# Altium project ESP32-power-controller.PrjPcb (part 2 of 2)

## Sheet SMPS_3V3.SchDoc
size A4; DocumentNumber: 3; SheetNumber: 3; SheetTotal: 4
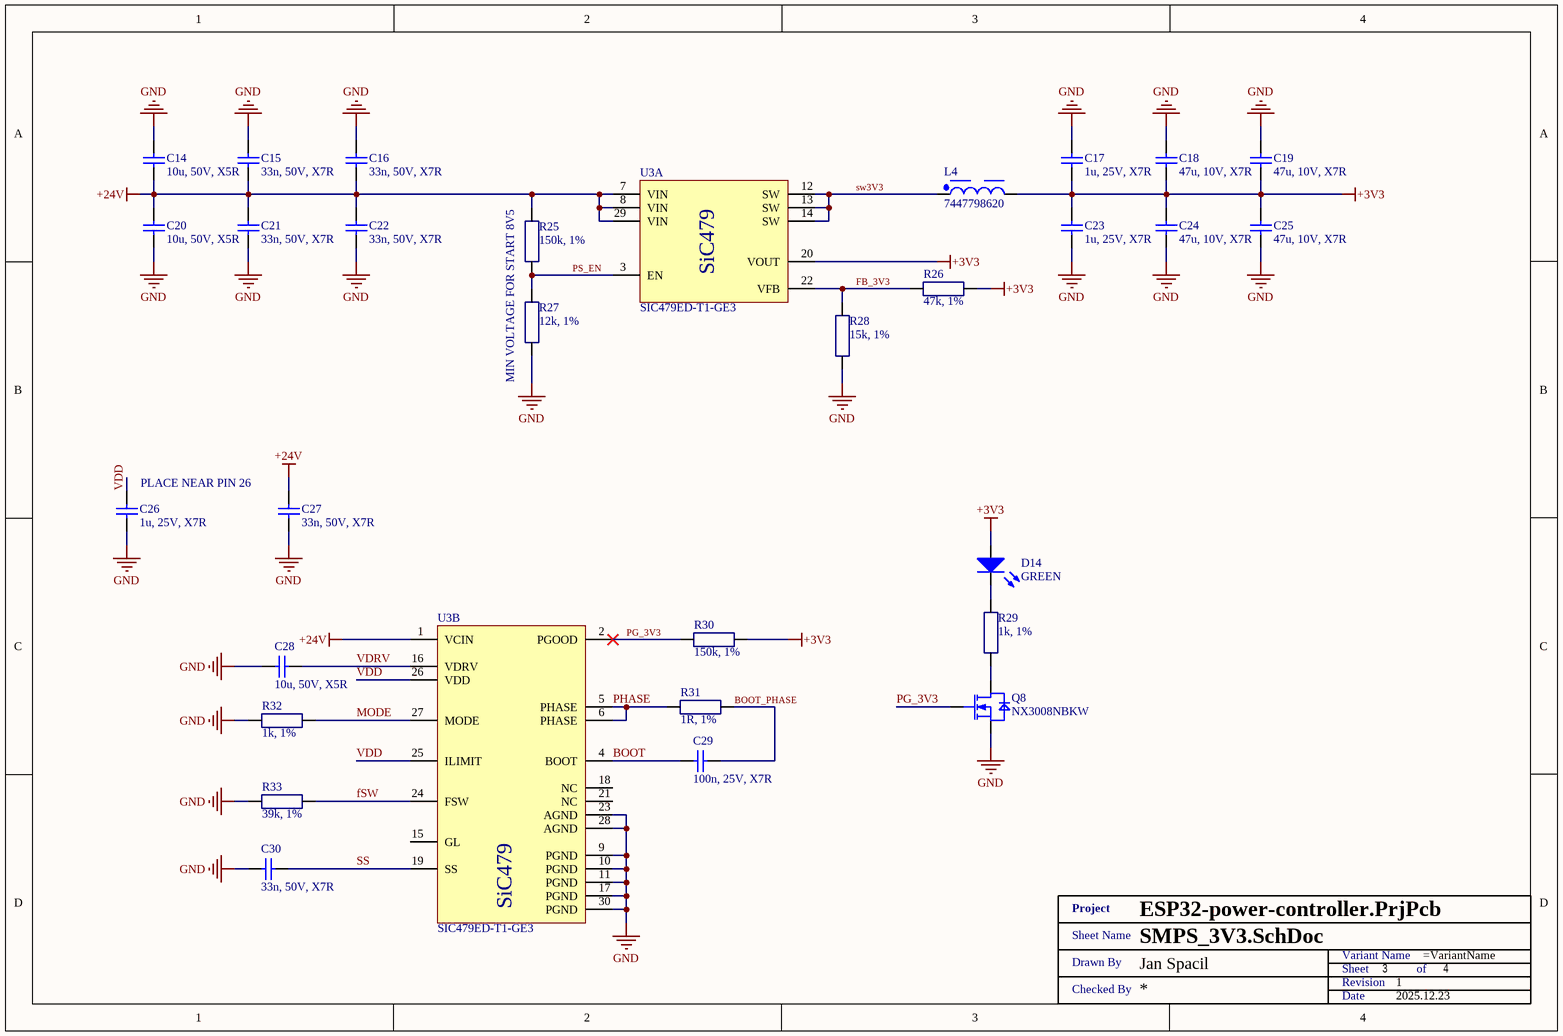
[diagram p2: SMPS_3V3.SchDoc]

### Parts
(Parts that share a designator on the sheet are numbered #1, #2 ... from top to bottom, then left to right.)
C14  10u, 50V, X5R  [SMD1206]
C15  33n, 50V, X7R  [SMD0603]
C16  33n, 50V, X7R  [SMD0603]
C17  1u, 25V, X7R  [SMD0603]
C18  47u, 10V, X7R  [SMD1210]
C19  47u, 10V, X7R  [SMD1210]
C20  10u, 50V, X5R  [SMD1206]
C21  33n, 50V, X7R  [SMD0603]
C22  33n, 50V, X7R  [SMD0603]
C23  1u, 25V, X7R  [SMD0603]
C24  47u, 10V, X7R  [SMD1210]
C25  47u, 10V, X7R  [SMD1210]
C26  1u, 25V, X7R  [SMD0603]
C27  33n, 50V, X7R  [SMD0603]
C28  10u, 50V, X5R  [SMD1206]
C29  100n, 25V, X7R  [SMD0603]
C30  33n, 50V, X7R  [SMD0603]
D14  GREEN  [MCL-S270]
L4  7447798620  [WE-PDF_1064]
Q8  NX3008NBKW  [SOT323]
R25  150k, 1%  [SMD0603 - R]
R26  47k, 1%  [SMD0603 - R]
R27  12k, 1%  [SMD0603 - R]
R28  15k, 1%  [SMD0603 - R]
R29  1k, 1%  [SMD0603 - R]
R30  150k, 1%  [SMD0603 - R]
R31  1R, 1%  [SMD0603 - R]
R32  1k, 1%  [SMD0603 - R]
R33  39k, 1%  [SMD0603 - R]
U3  SIC479ED-T1-GE3  [POWERPAK_MLP55-27L_VIS]  (parts A,B of 2)
XX?#3  Title 1  (value not drawn)  (graphical)

### Nets
+3V3: C17.1 C18.2 C19.2 C23.2 C24.2 C25.2 D14.1(A) L4.2 R26.2 R30.1 U3.20(VOUT)
+24V: C14.2 C15.1 C16.1 C20.2 C21.2 C22.2 C27.2 R25.2 U3.1(VCIN) U3.7(VIN) U3.8(VIN) U3.29(VIN)
GND: C14.1 C15.2 C16.2 C17.2 C18.1 C19.1 C20.1 C21.1 C22.1 C23.1 C24.1 C25.1 C26.1 C27.1 C28.2 C30.1 Q8.2(S) R27.1 R28.1 R32.1 R33.1 U3.9(PGND) U3.10(PGND) U3.11(PGND) U3.17(PGND) U3.23(AGND) U3.28(AGND) U3.30(PGND)
BOOT: C29.1 U3.4(BOOT)
BOOT_PHASE: C29.2 R31.2
FB_3V3: R26.1 R28.2 U3.22(VFB)
fSW: R33.2 U3.24(FSW)
MODE: R32.2 U3.27(MODE)
PG_3V3: Q8.1(G) R30.2 U3.2(PGOOD)
PHASE: R31.1 U3.5(PHASE) U3.6(PHASE)
PS_EN: R25.1 R27.2 U3.3(EN)
SS: C30.2 U3.19(SS)
sw3V3: L4.1 U3.12(SW) U3.13(SW) U3.14(SW)
VDD: C26.2 U3.25(ILIMIT) U3.26(VDD)
VDRV: C28.1 U3.16(VDRV)
NetD14_2: D14.2(K) R29.2
NetQ8_3: Q8.3(D) R29.1

Not connected (* = marked no-connect by the designer): U3 15(GL) 18(NC) 21(NC)

### Notes on the sheet
- MIN VOLTAGE FOR START 8V5
- (near C26) PLACE NEAR PIN 26
- (in symbol SIC479ED-T1-GE3, part A) SiC479
- (in symbol SIC479ED-T1-GE3, part B) SiC479
- (in symbol Title 1) Project; Sheet Name; Variant Name; Drawn By; Sheet; of; Revision; Checked By; Date

### Library data of the parts
C14 C20 C28 = UMK316BBJ106KL-T: CAP CER 10UF 50V X5R 1206; Manufacturer: Taiyo Yuden; Tolerance: 10%; Supplier 1: Mouser; Supplier Part Number 1: 963-UMK316BBJ106KL-T; Manufacturer Part Number: UMK316BBJ106KL-T; RoHS: Yes; Category: Ceramic Capacitors; Stock 1: 207945; Pricing 1: 1=0,42000, 10=0,18000, 100=0,12800, 500=0,11000, 1000=0,09700, 2000=0,08000 (USD); Mount: Surface Mount; Case/Package: 1206; Min Operating Temperature: -55°C; Max Operating Temperature: 85°C; Packaging: Tape and Reel; Capacitance: 10u; Voltage Rating: 50V; Length: 0.126inch; Width: 0.063inch; Thickness: 0.071inch; Lead Free: Lead Free; ComponentLink1URL: http://ds.yuden.co.jp/TYCOMPAS/ut/detail.do?productNo=UMK316BBJ106KL-T&fileName=UMK316BBJ106KL-T_SS&mode=specSheetDownload&src-supplier=Digi-Key; ComponentLink1Description: http://ds.yuden.co.jp/TYCOMPAS/ut/detail.do?productNo=UMK316BBJ106KL-T&fileName=UMK316BBJ106KL-T_SS&mode=specSheetDownload&src-supplier=Digi-Key; ComponentLink2URL: https://www.yuden.co.jp/productdata/catalog/mlcc01_e.pdf?src-supplier=Digi-Key; ComponentLink2Description: https://www.yuden.co.jp/productdata/catalog/mlcc01_e.pdf?src-supplier=Digi-Key; ComponentLink3URL: http://www.yuden.co.jp/productdata/catalog/en/mlcc_all_e.pdf?src-supplier=Digi-Key; ComponentLink3Description: http://www.yuden.co.jp/productdata/catalog/en/mlcc_all_e.pdf?src-supplier=Digi-Key; Supplier 2: Digi-Key; Supplier Part Number 2: 587-5960-1-ND; Supplier 3: Avnet; Supplier Part Number 3: UMK316BBJ106KL-T
C15 C16 C21 C22 C27 C30 = 06035C333JAT2A: 0603 33nF Ceramic Multilayer Capacitor; 50 V dc; +125degC; X7R Dielectric; +/-5%; Manufacturer: Kyocera AVX; Tolerance: 5%; Dissipation Factor: 2.5%; Supplier 1: Mouser; Supplier Part Number 1: 581-06035C333J; Manufacturer Part Number: 06035C333JAT2A; Stock 1: 266948; Pricing 1: 1 = 0.13000, 10 = 0.12100, 50 = 0.12100, 100 = 0.06000, 1000 = 0.03600, 10000 = 0.02400 (USD); RoHS: Yes; Mount: Surface Mount,PCB; Case/Package: 0603; Number of Pins: 2; Case Code (Metric): 1608; Case Code (Imperial): 0603; Contact Plating: Tin,Matte; Dielectric Material: Ceramic; Min Operating Temperature: -55°C; Max Operating Temperature: 125°C; Capacitance: 33n; Dielectric: X7R; Packaging: Tape and Reel; Voltage Rating (DC): 50V; Package Quantity: 1; Voltage Rating: 50V; Termination: SMD/SMT; Voltage: 50V; Length: 1.6mm; Height: 0.9mm; Width: 0.032inch; Depth: 0.81mm; Thickness: 0.035inch; Radiation Hardening: No; REACH SVHC: No SVHC; Lead Free: Lead Free; ComponentLink1URL: https://datasheet.ciiva.com/7855/1679506-7855093.pdf?src-supplier=Element14; ComponentLink1Description: https://datasheet.ciiva.com/7855/1679506-7855093.pdf?src-supplier=Element14; ComponentLink2URL: https://datasheet.ciiva.com/28694/cx7r-28694479.pdf?src-supplier=Element14; ComponentLink2Description: https://datasheet.ciiva.com/28694/cx7r-28694479.pdf?src-supplier=Element14; ComponentLink3URL: https://datasheet.ciiva.com/152/cx7r-152032.pdf?src-supplier=Digi-Key; ComponentLink3Description: https://datasheet.ciiva.com/152/cx7r-152032.pdf?src-supplier=Digi-Key; ComponentLink4URL: https://datasheet.ciiva.com/152/cx7r-152033.pdf?src-supplier=Digi-Key; ComponentLink4Description: https://datasheet.ciiva.com/152/cx7r-152033.pdf?src-supplier=Digi-Key; ComponentLink5URL: https://datasheet.ciiva.com/1457/84526-1457941.pdf?src-supplier=Element14; ComponentLink5Description: https://datasheet.ciiva.com/1457/84526-1457941.pdf?src-supplier=Element14; ComponentLink6URL: https://datasheet.ciiva.com/1457/84526-1457942.pdf?src-supplier=Element14; ComponentLink6Description: https://datasheet.ciiva.com/1457/84526-1457942.pdf?src-supplier=Element14; ComponentLink7URL: https://datasheet.ciiva.com/17084/cx7r-17084518.pdf?src-supplier=Future+Electronics; ComponentLink7Description: https://datasheet.ciiva.com/17084/cx7r-17084518.pdf?src-supplier=Future+Electronics; ComponentLink8URL: https://datasheet.ciiva.com/2987/cx7r-2987848.pdf?src-supplier=Avnet; ComponentLink8Description: https://datasheet.ciiva.com/2987/cx7r-2987848.pdf?src-supplier=Avnet; ComponentLink9URL: https://datasheet.ciiva.com/14605/70001075-14605242.pdf?src-supplier=Allied+Electronics; ComponentLink9Description: https://datasheet.ciiva.com/14605/70001075-14605242.pdf?src-supplier=Allied+Electronics; ComponentLink10URL: https://datasheet.ciiva.com/152/cx7r-152031.pdf?src-supplier=Digi-Key; ComponentLink10Description: https://datasheet.ciiva.com/152/cx7r-152031.pdf?src-supplier=Digi-Key; Supplier 2: Farnell; Supplier Part Number 2: 2280893; Supplier 3: Digi-Key; Supplier Part Number 3: 478-3723-1-ND; Supplier 4: Arrow; Supplier Part Number 4: 06035C333JAT2A
C17 C23 C26 = CGA3E1X7R1E105K080AC: CAP CER 1UF 25V X7R 0603; Manufacturer: TDK Corporation; Tolerance: ±10%; Manufacturer Part Number: CGA3E1X7R1E105K080AC; RoHS: RoHS Compliant; Category: Capacitors; Stock 1: 109509; Pricing 1: 1=0.2, 10=0.135, 100=0.0686, 500=0.04696, 1000=0.04154 (USD); Packaging: Cut Tape (CT); Part Status: Active; Voltage - Rated: 25V; Temperature Coefficient: X7R; Operating Temperature: -55°C ~ 125°C; Features: -; Ratings: AEC-Q200; Applications: Automotive; Failure Rate: -; Mounting Type: Surface Mount, MLCC; Package / Case: 0603 (1608 Metric); Size / Dimension: 0.063" L x 0.032" W (1.60mm x 0.80mm); Height - Seated (Max): -; Thickness (Max): 0.035" (0.90mm); Lead Spacing: -; Lead Style: -; ComponentLink1URL: https://product.tdk.com/info/en/catalog/datasheets/mlcc_automotive_general_en.pdf; ComponentLink1Description: https://product.tdk.com/info/en/catalog/datasheets/mlcc_automotive_general_en.pdf; Capacitance: 1u; Supplier 1: Mouser; Supplier Part Number 1: 810-CGA3E1X7R1E105K; Supplier 2: Farnell; Supplier Part Number 2: 2346962; Supplier 3: Digi-Key; Supplier Part Number 3: 445-6931-1-ND
C18 C19 C24 C25 = CL32B476MPJNNNE: Cap Ceramic 47uF 10V X7R 20% Pad SMD 1210 125C T/R; Manufacturer: Samsung; Supplier 1: Mouser; Supplier Part Number 1: 187-CL32B476MPJNNNE; Manufacturer Part Number: CL32B476MPJNNNE; RoHS: Yes; Category: Ceramic Capacitors; Stock 1: 61232; Pricing 1: 1=0.51, 10=0.377, 50=0.377, 100=0.263, 1000=0.198, 10000=0.163 (USD); Case/Package: 1210; Dielectric: X7R; Voltage Rating (DC): 10V; Tolerance: 20%; Value: 47uF; RoHS Compliant: Yes; ComponentLink1URL: http://www.samsungsem.com/kr/support/library/product-catalog/__icsFiles/afieldfile/2014/11/13/MLCC.pdf?src-supplier=Avnet; ComponentLink1Description: http://www.samsungsem.com/kr/support/library/product-catalog/__icsFiles/afieldfile/2014/11/13/MLCC.pdf?src-supplier=Avnet; Supplier 2: Arrow Electronics; Supplier Part Number 2: CL32B476MPJNNNE
C29 = 06033C104KAT2A: AVX - 06033C104KAT2A - CAP, MLCC, X7R, 0.1UF, 25V, 0603; Ceramic Capacitor Case: 0603 [1608 Metric]; Voltage Rating: 25; Capacitance Tolerance: ± 10%; Dielectric Characteristic: X7; Product Range: AVX 0603 MLCC; SVHC: No SVHC (17-Dec-2015)<!--FANDB--><div class="features-and-benefits-container"><div class="features-and-benefits-desc-container"><span class="features-and-benefits-container-desc">SMD Multilayer Ceramic Capacitor, 0603 [1608 Metric], 0.1 µF, 25 V, ± 10%, X7R, AVX 0603 MLCC</span></div><div class="features-and-benefits-description"><span class="features-benefits-value">The 06033C104KAT2A is a SMD Multilayer Ceramic Capacitor with Ni/Sn-plated termination, X7R dielectric and 0603 case. X7R formulations are called temperature stable ceramics and fall into EIA class II materials. X7R is the most popular of this intermediate dielectric constant material. This capacitance change is non-linear. Capacitance for X7R varies under the influence of electrical operating conditions such as voltage and frequency. X7; Supplier 1: Farnell; Supplier Part Number 1: 2530141; Manufacturer: AVX; Manufacturer Part Number: 06033C104KAT2A; RoHS: YES; Stock 1: 22809; Pricing 1: 10=0.012, 100=0.0096, 500=0.0069, 1000=0.006, 2000=0.0048, 4000=0.0038, 20000=0.0027, 40000=0.0026 (GBP); Capacitance: 100n; Packaging: Cut Tape; Operating Temperature Min: -55; Operating Temperature Max: 125; Automotive Qualification Standard: -; MSL: MSL 1 - Unlimited; ComponentLink1URL: http://www.farnell.com/datasheets/2237835.pdf; ComponentLink1Description: http://www.farnell.com/datasheets/2237835.pdf; Supplier 2: Digi-Key; Supplier Part Number 2: 478-3714-1-ND
D14 = MCL-S270GC: MULTICOMP - MCL-S270GC - LED, 0805, GREEN, 10MCD, 570NM; LED Mounting: SMD; Bulb Size: 1.25mm x 1.4; Forward Current If: 20; Forward Voltage: 2.1; Wavelength Typ: 570; Luminous Intensity: 10; Viewing Angle: 140°; Lens Shape: Rectangular; SVHC: No SVHC (17-Dec-2015); Forward Voltage VF Max: 2.6; LED / Lamp Size: 1.4mm x 1.25; LED Type: Standard; Luminous Intensity Max: 16; Luminous Intensity Min: 4.5; No. of Pins: 2; Peak Forward Current: 100; Peak Wavelength: 568; Reverse Protection Voltage: 5; Voltage Vf Min: 1.7; Voltage Vf Typ: 2.1V<!--FANDB--><div class="features-and-benefits-container"><div class="features-and-benefits-description"><span class="features-benefits-value">The MCL-S270GC is a green SMD LED made of GaP dice. This LED offers water clear rectangular lens and 260°C for 5 seconds lead soldering temperature range 1.6mm from body.</span></div><div class="features-and-benefits-list"><ul class="features-and-benefits-list-list"><li class="features-and-benefits-list-item">-40 to 85; Manufacturer: MULTICOMP; Manufacturer Part Number: MCL-S270GC; RoHS: YES; Stock 1: 80989; Pricing 1: 5=0,145, 25=0,136, 100=0,126, 250=0,0813, 500=0,0645, 2000=0,0559, 5000=0,0496, 20000=0,0434 (GBP); LED Colour: Green; Packaging: Cut Tape; Product Range: -; Automotive Qualification Standard: -; MSL: MSL 3 - 168 hours; Current Rating: 20; Dominant Wavelength: 570; Dominant Wavelength Typ: 570; Forward Current If Max: 20; Luminous Intensity Typ: 10; Operating Temperature Max: 85; Operating Temperature Min: -40; Operating Temperature Range: -40°C to +85; Storage Temperature Max: +100; Storage Temperature Min: -40; ComponentLink1URL: http://www.farnell.com/cad/53028.pdf; ComponentLink1Description: http://www.farnell.com/cad/53028.pdf; ComponentLink2URL: http://www.farnell.com/datasheets/1671537.pdf; ComponentLink2Description: http://www.farnell.com/datasheets/1671537.pdf; Supplier 1: Farnell; Supplier Part Number 1: 1581242; Supplier 2: Newark; Supplier Part Number 2: 14N9356
L4 = CMP-0227-00046-2: NexarPartId: 14415868; Tolerance: 30%; RMS Current (Irms): 9.4A; Shielding: Shielded; DC Resistance (DCR): 8.4mΩ; Self Resonant Frequency: 33MHz; Max DC Current: 7A; Test Frequency: 100kHz; Core Material: Composite, Ferrite, Metal; Inductance: 6.2µH; Saturation Current: 6.7A; Number of Pins: 2; Depth: 10.2mm; Length: 10.2mm; Termination: SMD/SMT; Ambient Temperature Range High: 110°C; Max Operating Temperature: 150°C; Mount: Surface Mount; Lead Pitch: 5.8mm; Inductance Tolerance: 30%; REACH SVHC: No SVHC; Width: 10.2mm; Min Operating Temperature: -40°C; Case/Package: 1064; Height - Seated (Max): 6.4008mm; RoHS: Compliant; Current Rating: 9.4A; Ambient Temperature Range Low: -40°C; Height: 6.1mm; Composition: Wirewound; Packaging: Tape & Reel (TR)
Q8 = NX3008NBKW: NXP - NX3008NBKW - MOSFET, N CH, 30V, 350MA, SOT323; Transistor Polarity: N Channel; Continuous Drain Current Id: 350; Drain Source Voltage Vds: 30; On Resistance Rds(on): 1; Rds(on) Test Voltage Vgs: 4.5; Threshold Voltage Vgs: 900; Power Dissipation Pd: 260; Transistor Case Style: SOT-323; No. of Pins: 3; SVHC: No SVHC (17-Dec-2015); Pulse Current Idm: -0.8; Voltage Vgs th Max: 8; Manufacturer: NXP; Manufacturer Part Number: NX3008NBKW; RoHS: YES; Stock 1: 4764; Pricing 1: 1=0.0425, 25=0.0385, 100=0.0347, 250=0.0334, 500=0.0312, 2000=0.0291, 4000=0.0282, 20000=0.0273 (GBP); Operating Temperature Max: 150; Product Range: -; Automotive Qualification Standard: -; MSL: MSL 1 - Unlimited; Operating Temperature Min: -55; Operating Temperature Range: -55°C to +150; ComponentLink1URL: http://www.farnell.com/datasheets/1508392.pdf; ComponentLink1Description: http://www.farnell.com/datasheets/1508392.pdf; Supplier 1: Mouser; Supplier Part Number 1: 771-NX3008NBKW,115; Supplier 2: Farnell; Supplier Part Number 2: 2069546; Supplier 3: Arrow; Supplier Part Number 3: NX3008NBKW,115
R25 R30 = RC0603FR-07150KL: YAGEO - RC0603FR-07150KL - RES, 150K, 1%, 0.1W, 0603, THICK FILM; Product Range: RC Series; Voltage Rating: 75; Resistor Case Style: 0603 [1608 Metric]; Power Rating: 100; Temperature Coefficient: ± 100; SVHC: No SVHC (27-Jun-2018); External Depth: 0.45; External Length / Height: 1.6; External Width: 0.8; Full Power Rating Temperature: 70; No. of Pins: 2; Reel Quantity: 5000; Resistor Mounting: Surface Mount Device; Voltage Rating V DC: 50V<!--FANDB--><div class="features-and-benefits-container"><div class="features-and-benefits-desc-container"><span class="features-and-benefits-container-desc">SMD Chip Resistor, 150 kohm, RC Series, 75 V, Thick Film, 0603 [1608 Metric], 100 mW</span></div><div class="features-and-benefits-description"><span class="features-benefits-value">The Yageo RC_L series resistors are general purpose thick film chip resistors with lead free terminations made by thick film process. The resistance range includes E24 and E96 decade values from 1ohm to 100Mohm. These resistors are constructed on top of a high grade ceramic body.</span></div><div class="features-and-benefits-list"><ul class="features-and-benefits-list-list"><li class="features-and-benefits-list-item">EIA 0075, 0100, 0201, 0402, 0603, 0805, 1206, 1210, 1218, 2010, 2512 case sizes available</li><li class="features-and-benefits-list-item">Small chip sizes save PCB space</li><li class="features-and-benefits-list-item">Rated voltage range of 10V to 200V</li><li class="features-and-benefits-list-item">Maximum power rating of 2W</li><li class="features-and-benefits-list-item">Available in ±0.1%, ±0.5%, ±1% and ±5% tolerance</li><li class="features-and-benefits-list-item">High component and equipment reliability</li><li class="features-and-benefits-list-item">Forbidden materials are not used in products/production</li><li class="features-and-benefits-list-item">-55°C to 155°C temperature range for RC0402 to RC2512 and -55°C to 125°C for RC0075 to RC0201; Manufacturer: YAGEO; Manufacturer Part Number: RC0603FR-07150KL; RoHS: YES; Pricing 1: 10=0.678, 100=0.557, 500=0.39, 1000=0.326, 2500=0.244 (EUR); Resistance: 150k; Resistor Element Material: Thick Film; Resistance Tolerance: ± 1%; Automotive Qualification Standard: -; MSL: MSL 1 - Unlimited; Operating Temperature Max: 155; Operating Temperature Min: -55; Operating Temperature Range: -55°C to +155; Temperature Coeff. +: 100; Temperature Coeff. -: 100; Tolerance +: 1%; Tolerance -: 1%; ComponentLink1URL: http://www.farnell.com/datasheets/2167052.pdf; ComponentLink1Description: http://www.farnell.com/datasheets/2167052.pdf; ComponentLink2URL: http://www.farnell.com/cad/1555201.zip; ComponentLink2Description: http://www.farnell.com/cad/1555201.zip; Supplier 1: Mouser; Supplier Part Number 1: 603-RC0603FR-07150KL; Supplier 2: Farnell; Supplier Part Number 2: 9238743; Supplier 3: Digi-Key; Supplier Part Number 3: 311-150KHRCT-ND
R26 = RC0603FR-0747KL: RES SMD 47K OHM 1% 1/10W 0603; Manufacturer: Yageo; Temperature Coefficient: 100ppm/°C; Voltage Rating (DC): 50V; Power Rating: 100mW; Supplier 1: Mouser; Supplier Part Number 1: 603-RC0603FR-0747KL; Manufacturer Part Number: RC0603FR-0747KL; Stock 1: 2684548; Pricing 1: 1 = 0.10000, 10 = 0.01800, 50 = 0.01800, 100 = 0.00600, 1000 = 0.00500, 5000 = 0.00300, 10000 = 0.00300, 50000 = 0.00200 (USD); RoHS: Yes; Case/Package: 0603; Number of Pins: 2; Case Code (Metric): 1608; Case Code (Imperial): 0603; Min Operating Temperature: -55°C; Max Operating Temperature: 155°C; Tolerance: 1%; Composition: Thick Film; Resistance: 47k; Packaging: Tape and Reel; Voltage Rating: 50V; Package Quantity: 1; Number of Terminations: 2; Termination: SMD/SMT; Military Standard: Not; Max Power Dissipation: 100mW; Features: Moisture Resistant; Length: 1.6mm; Height: 0.022inch; Width: 0.031inch; Depth: 0.8mm; REACH SVHC: Unknown; Lead Free: Lead Free; ComponentLink1URL: https://datasheet.ciiva.com/11808/0900766b80f96399-11808118.pdf?src-supplier=RSComponents; ComponentLink1Description: https://datasheet.ciiva.com/11808/0900766b80f96399-11808118.pdf?src-supplier=RSComponents; ComponentLink2URL: https://datasheet.ciiva.com/7746/443971-7746361.pdf?src-supplier=Element14; ComponentLink2Description: https://datasheet.ciiva.com/7746/443971-7746361.pdf?src-supplier=Element14; ComponentLink3URL: https://datasheet.ciiva.com/7746/443971-7746362.pdf?src-supplier=Element14; ComponentLink3Description: https://datasheet.ciiva.com/7746/443971-7746362.pdf?src-supplier=Element14; ComponentLink4URL: https://datasheet.ciiva.com/2453/pyu-r-int-thick-7-2453931.pdf?src-supplier=Digi-Key; ComponentLink4Description: https://datasheet.ciiva.com/2453/pyu-r-int-thick-7-2453931.pdf?src-supplier=Digi-Key; ComponentLink5URL: https://datasheet.ciiva.com/2453/pyu-r-int-thick-7-2453932.pdf?src-supplier=Digi-Key; ComponentLink5Description: https://datasheet.ciiva.com/2453/pyu-r-int-thick-7-2453932.pdf?src-supplier=Digi-Key; ComponentLink6URL: https://datasheet.ciiva.com/2453/pyu-r-int-thick-7-2453933.pdf?src-supplier=Digi-Key; ComponentLink6Description: https://datasheet.ciiva.com/2453/pyu-r-int-thick-7-2453933.pdf?src-supplier=Digi-Key; Supplier 2: Farnell; Supplier Part Number 2: 2421877; Supplier 3: Digi-Key; Supplier Part Number 3: 311-47.0KHRCT-ND
R27 = RCS060312K0FKEA: RES SMD 12K OHM 1% 1/4W 0603; Manufacturer: Vishay Dale; Power (Watts): 0.25W, 1/4W; Temperature Coefficient: ±100ppm/°C; Manufacturer Part Number: RCS060312K0FKEA; RoHS: RoHS Compliant; Category: Resistors; Stock 1: 0; Pricing 1: 5000=0.01664, 10000=0.01513 (USD); Packaging: Tape & Reel (TR); Part Status: Active; Tolerance: ±1%; Composition: Thick Film; Features: Automotive AEC-Q200, Pulse Withstanding; Operating Temperature: -55°C ~ 155°C; Package / Case: 0603 (1608 Metric); Supplier Device Package: 0603; Size / Dimension: 0.061" L x 0.033" W (1.55mm x 0.85mm); Height - Seated (Max): 0.020" (0.50mm); Failure Rate: -; ComponentLink1URL: http://www.vishay.com/docs/20065/rcse3.pdf; ComponentLink1Description: http://www.vishay.com/docs/20065/rcse3.pdf; Resistance: 12k; Supplier 1: Mouser; Supplier Part Number 1: 71-RCS060312K0FKEA; Supplier 2: Farnell; Supplier Part Number 2: 3294375; Supplier 3: Digi-Key; Supplier Part Number 3: RCS060312K0FKEA-ND
R28 = RC0603FR-0715KL: Res Thick Film 0603 15K Ohm 1% 1/10W ?100ppm/?C Molded SMD Paper T/R; Manufacturer: Yageo; Temperature Coefficient: 100ppm/°C; Power Rating: 100mW; Voltage Rating (DC): 50V; Supplier 1: Mouser; Supplier Part Number 1: 603-RC0603FR-0715KL; Manufacturer Part Number: RC0603FR-0715KL; RoHS: Yes; Category: Chip SMD Resistors; Stock 1: 815640; Pricing 1: 1=0,10000, 10=0,01800, 50=0,01800, 100=0,00600, 1000=0,00500, 10000=0,00300 (USD); Case/Package: 0603; Number of Pins: 2; Case Code (Metric): 1608; Case Code (Imperial): 0603; Size Code: 0603; Min Operating Temperature: -55°C; Max Operating Temperature: 155°C; Tolerance: 1%; Resistance: 15k; Resistor Type: Thick Film; Packaging: Tape and Reel; Series: RC; Package Quantity: 1; Voltage Rating: 50V; Number of Terminations: 2; Termination: SMD/SMT; Max Power Dissipation: 100mW; Features: Moisture Resistant; Resistance Tolerance: 1%; Construction: Rectangular; Length: 1.6mm; Width: 0.031inch; Height: 0.022inch; Depth: 0.8mm; Lead Free: Lead Free; RoHS Compliant: Yes; REACH SVHC: Unknown; Military Standard: Not; ComponentLink1URL: https://datasheet.ciiva.com/2453/pyu-r-int-thick-7-2453907.pdf?src-supplier=Digi-Key; ComponentLink1Description: https://datasheet.ciiva.com/2453/pyu-r-int-thick-7-2453907.pdf?src-supplier=Digi-Key; ComponentLink2URL: https://datasheet.ciiva.com/2453/pyu-r-int-thick-7-2453908.pdf?src-supplier=Digi-Key; ComponentLink2Description: https://datasheet.ciiva.com/2453/pyu-r-int-thick-7-2453908.pdf?src-supplier=Digi-Key; ComponentLink3URL: https://datasheet.ciiva.com/2453/pyu-r-int-thick-7-2453909.pdf?src-supplier=Digi-Key; ComponentLink3Description: https://datasheet.ciiva.com/2453/pyu-r-int-thick-7-2453909.pdf?src-supplier=Digi-Key; ComponentLink4URL: https://datasheet.ciiva.com/15189/getdatasheetpartid-327895-15189613.pdf?src-supplier=Verical; ComponentLink4Description: https://datasheet.ciiva.com/15189/getdatasheetpartid-327895-15189613.pdf?src-supplier=Verical; Supplier 2: Farnell; Supplier Part Number 2: 3495741; Supplier 3: Digi-Key; Supplier Part Number 3: 311-15.0KHRCT-ND
R29 R32 = MCWR06X1001FTL: MULTICOMP - MCWR06X1001FTL - RES, THICK FILM, 1K, 1%, 0.1W, 0603; Voltage Rating: 50; Resistor Case Style: 0603 [1608 Metric]; Power Rating: 100; Product Range: MCWR Series; Temperature Coefficient: ± 100; SVHC: No SVHC (07-Jul-2017)<!--FANDB--><div class="features-and-benefits-container"><div class="features-and-benefits-desc-container"><span class="features-and-benefits-container-desc">SMD Chip Resistor, Thick Film, 1 kohm, 50 V, 0603 [1608 Metric], 100 mW, ± 1; Manufacturer: MULTICOMP; Manufacturer Part Number: MCWR06X1001FTL; RoHS: Y-EX; Stock 1: 134740; Pricing 1: 10=0.0037, 100=0.0022, 500=0.0016, 1000=0.0012, 2500=0.001 (GBP); Resistance: 1k; Resistance Tolerance: ± 1%; Packaging: Cut Tape; Resistor Element Material: Thick Film; Automotive Qualification Standard: -; ComponentLink1URL: http://www.farnell.com/datasheets/1849611.pdf; ComponentLink1Description: http://www.farnell.com/datasheets/1849611.pdf; Supplier 1: Farnell; Supplier Part Number 1: 2447272; Supplier 2: Newark; Supplier Part Number 2: 94X1378
R31 = RC0603FR-071RL: SMD Chip Resistor, 1 Ohm, ± 1%, 100 mW, 0603 [1608 Metric], Thick Film, General Purpose; Manufacturer: Yageo; Power Rating: 100mW; Voltage Rating: 50V; Temperature Coefficient: 200ppm/°C; Supplier 1: Mouser; Supplier Part Number 1: 603-RC0603FR-071RL; Manufacturer Part Number: RC0603FR-071RL; RoHS: Yes; Category: Chip SMD Resistors; Stock 1: 1036633; Pricing 1: 1=0,1, 10=0,018, 50=0,018, 100=0,011, 1000=0,009, 10000=0,004 (USD); Case/Package: 0603; Pins: 2; Case Code (Imperial): 0603; Case Code (Metric): 1608; Min Operating Temperature: -55°C; Max Operating Temperature: 155°C; Resistance: 1R; Tolerance: 1%; Packaging: Tape and Reel; Voltage Rating (DC): 50V; Package Quantity: 1; Resistor Type: Thick Film; Termination: SMD/SMT; Number of Terminations: 2; Max Power Dissipation: 100mW; Features: Moisture Resistant; Series: RC; Technology: THICK FILM; Resistance Tolerance: 1%; Length: 0.063inch; Width: 0.031inch; Height: 0.022inch; Depth: 0.8mm; Lead Free: Lead Free; RoHS Compliant: Yes; Reach SVHC Compliant: Unknown; ComponentLink1URL: https://datasheet.ciiva.com/11808/0900766b80f96399-11808162.pdf?src-supplier=Rs; ComponentLink1Description: https://datasheet.ciiva.com/11808/0900766b80f96399-11808162.pdf?src-supplier=Rs; ComponentLink2URL: https://datasheet.ciiva.com/6547/pyu-r-int-thick-7-6547270.pdf?src-supplier=Digi-Key; ComponentLink2Description: https://datasheet.ciiva.com/6547/pyu-r-int-thick-7-6547270.pdf?src-supplier=Digi-Key; ComponentLink3URL: https://datasheet.ciiva.com/6547/pyu-r-int-thick-7-6547271.pdf?src-supplier=Digi-Key; ComponentLink3Description: https://datasheet.ciiva.com/6547/pyu-r-int-thick-7-6547271.pdf?src-supplier=Digi-Key; ComponentLink4URL: https://datasheet.ciiva.com/6547/pyu-r-int-thick-7-6547269.pdf?src-supplier=Digi-Key; ComponentLink4Description: https://datasheet.ciiva.com/6547/pyu-r-int-thick-7-6547269.pdf?src-supplier=Digi-Key; ComponentLink5URL: https://datasheet.ciiva.com/7746/1738695-7746296.pdf?src-supplier=Element14; ComponentLink5Description: https://datasheet.ciiva.com/7746/1738695-7746296.pdf?src-supplier=Element14; ComponentLink6URL: https://datasheet.ciiva.com/7746/1738695-7746297.pdf?src-supplier=Element14; ComponentLink6Description: https://datasheet.ciiva.com/7746/1738695-7746297.pdf?src-supplier=Element14; Supplier 2: Newark; Supplier Part Number 2: 75X0138; Supplier 3: Digi-Key; Supplier Part Number 3: 311-1.00HRCT-ND
R33 = RC0603FR-0739KL: RES SMD 39K OHM 1% 1/10W 0603; Manufacturer: Yageo; Temperature Coefficient: 100ppm/°C; Voltage Rating (DC): 50V; Power Rating: 100mW; Supplier 1: Mouser; Supplier Part Number 1: 603-RC0603FR-0739KL; Manufacturer Part Number: RC0603FR-0739KL; Stock 1: 607854; Pricing 1: 1 = 0.10000, 10 = 0.01800, 50 = 0.01800, 100 = 0.00600, 1000 = 0.00500, 10000 = 0.00300 (USD); RoHS: Yes; Case/Package: 0603; Number of Pins: 2; Case Code (Imperial): 0603; Case Code (Metric): 1608; Min Operating Temperature: -55°C; Max Operating Temperature: 155°C; Tolerance: 1%; Resistance: 39k; Composition: Thick Film; Packaging: Tape and Reel; Voltage Rating: 50V; Termination: SMD/SMT; Military Standard: Not; Length: 1.6mm; Height: 0.45mm; Width: 0.8mm; Depth: 0.8mm; REACH SVHC: No SVHC; Lead Free: Lead Free; ComponentLink1URL: https://datasheet.ciiva.com/11819/0900766b80f96399-11819356.pdf?src-supplier=RSComponents; ComponentLink1Description: https://datasheet.ciiva.com/11819/0900766b80f96399-11819356.pdf?src-supplier=RSComponents; ComponentLink2URL: https://datasheet.ciiva.com/7746/443971-7746341.pdf?src-supplier=Element14; ComponentLink2Description: https://datasheet.ciiva.com/7746/443971-7746341.pdf?src-supplier=Element14; Supplier 2: Arrow; Supplier Part Number 2: RC0603FR-0739KL; Supplier 3: Farnell; Supplier Part Number 3: 9238670; Supplier 4: Digi-Key; Supplier Part Number 4: 311-39.0KHRCT-ND; Supplier 5: Newark; Supplier Part Number 5: 98K7406
U3 = SIC479ED-T1-GE3: Switching Voltage Regulators microBUCK 4.5-55V; 3A; Manufacturer: Vishay; Supplier 1: Mouser; Supplier Part Number 1: 78-SIC479ED-T1-GE3; Manufacturer Part Number: SIC479ED-T1-GE3; RoHS: Yes; Category: Voltage Regulators - Switching; Stock 1: 3358; Pricing 1: 1=4.1, 10=3.69, 50=3.41, 100=3.02, 1000=2.41, 10000=2.4 (USD); ComponentLink1URL: http://www.vishay.com/docs/77113/sic47x.pdf?src-supplier=Digi-Key; ComponentLink1Description: http://www.vishay.com/docs/77113/sic47x.pdf?src-supplier=Digi-Key; ComponentLink2URL: https://datasheet.octopart.com/SIC479ED-T1-GE3-Vishay-datasheet-156007660.pdf?src-supplier=Future+Electronics; ComponentLink2Description: https://datasheet.octopart.com/SIC479ED-T1-GE3-Vishay-datasheet-156007660.pdf?src-supplier=Future+Electronics; Supplier 2: Digi-Key; Supplier Part Number 2: 742-SIC479ED-T1-GE3CT-ND; Supplier 3: Newark; Supplier Part Number 3: 23AH3586; Supplier 4: Farnell; Supplier Part Number 4: 3212621

## Sheet Power_input.SchDoc
size A4; DocumentNumber: 4; SheetNumber: 4; SheetTotal: 4
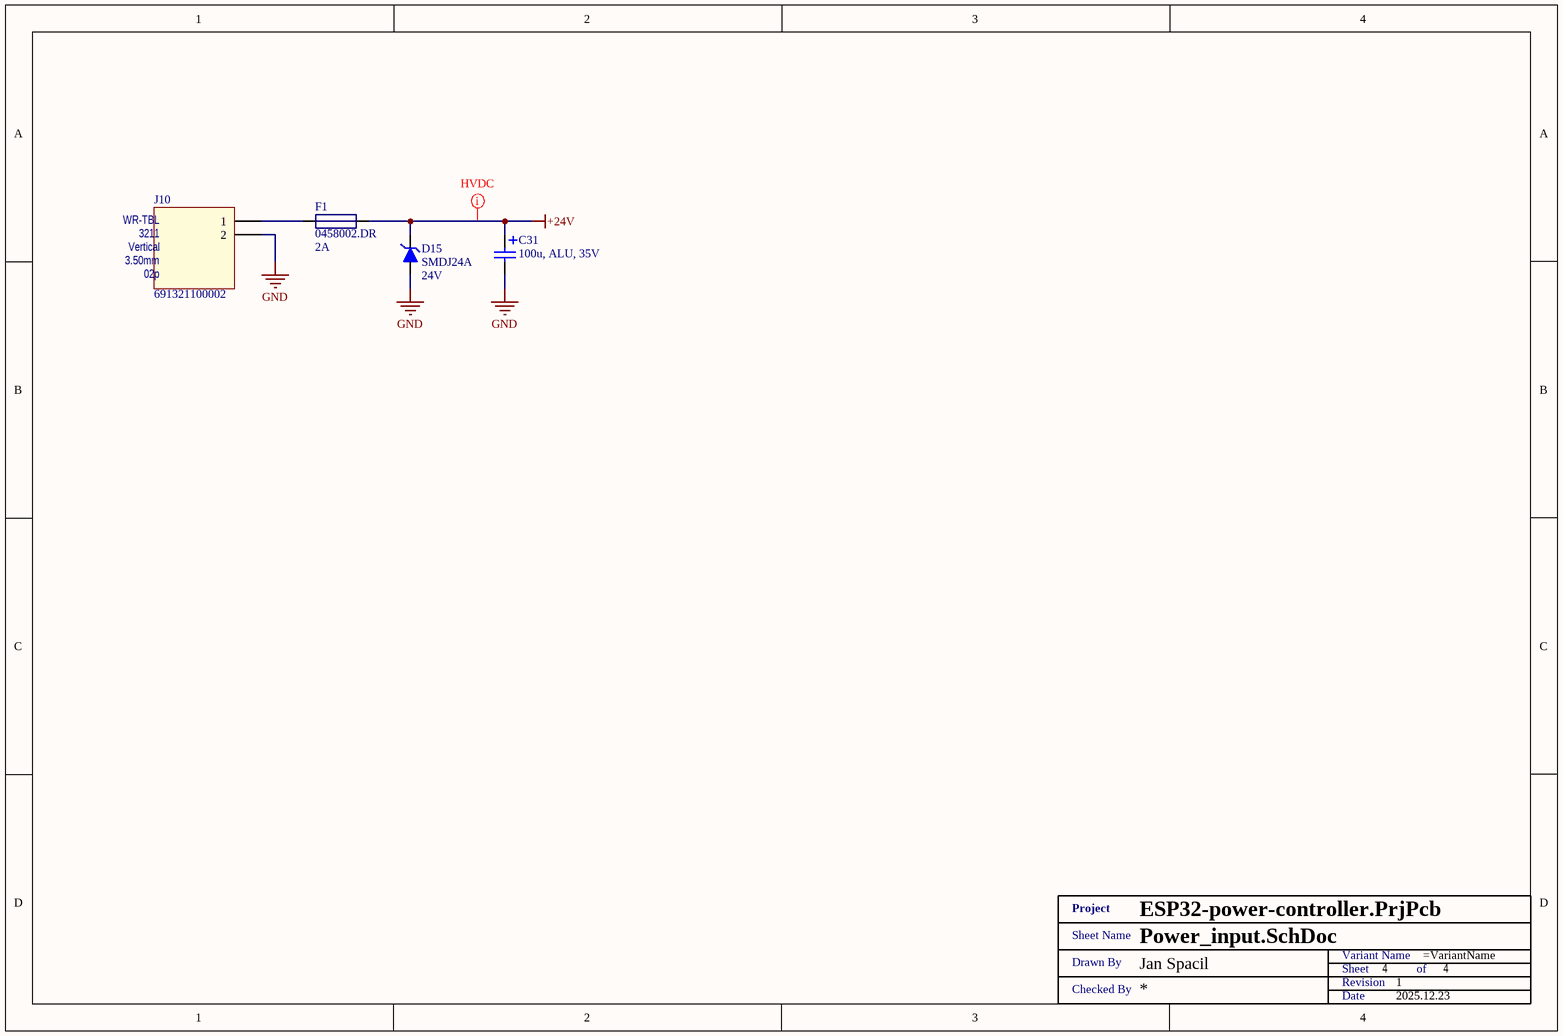
[diagram p3: Power_input.SchDoc]

### Parts
(Parts that share a designator on the sheet are numbered #1, #2 ... from top to bottom, then left to right.)
C31  100u, ALU, 35V  [WCAP-ATLI_6.3x11x2.5]
D15  SMDJ24A  Reverse Standoff Voltage: 24V  [DO-214AB]
F1  0458002.DR  Current Rating: 2A  [SMD1206 - FUSE]
J10  691321100002  [691321100002]
XX?#4  Title 1  (value not drawn)  (graphical)

### Nets
+24V: C31.1 D15.1 F1.2
GND: C31.2 D15.2 J10.2
NetF1_1: F1.1 J10.1

### Layout directives
net class HVDC: +24V

### Notes on the sheet
- (in symbol 691321100002) WR-TBL; 3211; 3.50mm; 02p
- (in symbol Title 1) Project; Sheet Name; Variant Name; Drawn By; Sheet; of; Revision; Checked By; Date

### Library data of the parts
C31 = 860010573007: WURTH ELEKTRONIK         860010573007             Electrolytic Capacitor, 100 F, 35 V, WCAP-ATG8 Series,  20%, Radial Leaded, 6.3 mm; Manufacturer: Wurth Electronics; Polarity: Polar; Ripple Current: 231mA; Life (Hours): 2000Hour; Capacitance: 100uF; Supplier 1: Mouser; Supplier Part Number 1: 710-860010573007; Manufacturer Part Number: 860010573007; RoHS: Yes; Category: Aluminum Electrolytic Capacitors; Stock 1: 1755; Pricing 1: 1=0.16000, 10=0.15100, 25=0.15100, 50=0.12700, 100=0.11100, 250=0.09800 (USD); Mount: Through Hole; Case/Package: Radial; Min Operating Temperature: -40°C; Max Operating Temperature: 85°C; Package Quantity: 1; Tolerance: 20%; Packaging: Tape and Reel; Voltage Rating: 35V; Voltage Rating (DC): 35V; Diameter: 6.3mm; Height: 11mm; Lead Pitch: 0.098inch; Height - Seated (Max): 0.492inch; REACH SVHC: Unknown; ComponentLink1URL: http://www.farnell.com/datasheets/1879547.pdf?src-supplier=Farnell; ComponentLink1Description: http://www.farnell.com/datasheets/1879547.pdf?src-supplier=Farnell; ComponentLink2URL: http://katalog.we-online.de/pbs/datasheet/860010573007.pdf?src-supplier=Digi-Key; ComponentLink2Description: http://katalog.we-online.de/pbs/datasheet/860010573007.pdf?src-supplier=Digi-Key; ComponentLink3URL: http://www.farnell.com/datasheets/1879547.pdf?src-supplier=Element14; ComponentLink3Description: http://www.farnell.com/datasheets/1879547.pdf?src-supplier=Element14; Supplier 2: Digi-Key; Supplier Part Number 2: 732-8737-1-ND
D15 = SMDJ24A: ESD Suppressors / TVS Diodes 5kW 24V 5% Uni-Directional; Manufacturer: Littelfuse; Manufacturer Part Number: 5.0SMDJ24A; Reverse Breakdown Voltage: 26.7V; Clamping Voltage: 38.9V; Polarity: Unidirectional; Number of Unidirectional Channels: 1; Power Line Protection: No; Peak Pulse Current: 129A; Test Current: 1mA; Leakage Current: 5uA; Diode Type: ZENER; Max Power Dissipation: 6.5W; Max Breakdown Voltage: 29.5V; Supplier 1: Mouser; Supplier Part Number 1: 576-5.0SMDJ24A; RoHS: Yes; Category: TVS Diodes; Stock 1: 2732; Pricing 1: 1=1.78000, 10=1.60000, 50=1.60000, 100=1.29000, 500=1.06000, 1000=0.87700, 3000=0.84900, 10000=0.84900 (USD); Mount: Surface Mount; Case/Package: DO-214AB; Number of Pins: 2; Min Operating Temperature: -65°C; Max Operating Temperature: 150°C; Package Quantity: 3000; Packaging: Tape and Reel; Peak Pulse Power: 5kW; Min Breakdown Voltage: 26.7V; Number of Elements: 1; Resistor Type: Zener; Series: 5.0SMDJ; Operating Supply Voltage: 24V; Max Surge Current: 129A; Breakdown Voltage: 26.7V; Number of Channels: 1; Termination: SMD/SMT; RoHS Compliant: Yes; REACH SVHC: No SVHC; Lead Free: Lead Free; ComponentLink1URL: https://datasheet.ciiva.com/332/littelfuse-tvs-diode-5-0smdj-datasheet-pdf-332921.pdf?src-supplier=Digi-Key; ComponentLink1Description: https://datasheet.ciiva.com/332/littelfuse-tvs-diode-5-0smdj-datasheet-pdf-332921.pdf?src-supplier=Digi-Key; ComponentLink2URL: https://datasheet.ciiva.com/332/littelfuse-tvs-diode-5-0smdj-datasheet-pdf-332922.pdf?src-supplier=Digi-Key; ComponentLink2Description: https://datasheet.ciiva.com/332/littelfuse-tvs-diode-5-0smdj-datasheet-pdf-332922.pdf?src-supplier=Digi-Key; ComponentLink3URL: https://datasheet.ciiva.com/332/littelfuse-tvs-diode-5-0smdj-datasheet-pdf-332920.pdf?src-supplier=Digi-Key; ComponentLink3Description: https://datasheet.ciiva.com/332/littelfuse-tvs-diode-5-0smdj-datasheet-pdf-332920.pdf?src-supplier=Digi-Key
F1 = 0458002.DR: FUSE BRD MNT 2A 48VAC 75VDC 1206; Manufacturer: Littelfuse; Body Material: Ceramic; Voltage Rating (AC): 48V; Voltage Rating (DC): 75V; Resistance: 69.5mR; DC Cold Resistance: 63.5mR; Fuse Type: Board Mount (Cartridge Style Excluded); Voltage Rating: 63V; Approvals: cULus; Supplier 1: Mouser; Supplier Part Number 1: 576-0458002.DR; Manufacturer Part Number: 0458002.DR; Stock 1: 11466; Pricing 1: 1 = 1.31000, 10 = 0.97500, 50 = 0.97500, 100 = 0.81200, 1000 = 0.67000, 10000 = 0.50800 (USD); RoHS: Yes; Mount: Surface Mount; Case/Package: 1206; Case Code (Metric): 3216; Case Code (Imperial): 1206; Housing Material: Ceramic; Min Operating Temperature: -55°C; Max Operating Temperature: 125°C; Packaging: Tape and Reel; Package Quantity: 1500; Fuse Current: 2A; Termination: SMD/SMT; Working Voltage: 63V; Length: 0.125inch; Height: 0.062inch; Width: 1.575mm; Depth: 1.58mm; REACH SVHC: No SVHC; Lead Free: Lead Free; ComponentLink1URL: https://datasheet.ciiva.com/1730/337915-1730544.pdf?src-supplier=Newark; ComponentLink1Description: https://datasheet.ciiva.com/1730/337915-1730544.pdf?src-supplier=Newark; ComponentLink2URL: https://datasheet.ciiva.com/299/littelfuse-fuse-458-series-299804.pdf?src-supplier=Digi-Key; ComponentLink2Description: https://datasheet.ciiva.com/299/littelfuse-fuse-458-series-299804.pdf?src-supplier=Digi-Key; ComponentLink3URL: https://datasheet.ciiva.com/299/littelfuse-fuse-458-series-299805.pdf?src-supplier=Digi-Key; ComponentLink3Description: https://datasheet.ciiva.com/299/littelfuse-fuse-458-series-299805.pdf?src-supplier=Digi-Key; ComponentLink4URL: https://datasheet.ciiva.com/299/littelfuse-fuse-458-series-299806.pdf?src-supplier=Digi-Key; ComponentLink4Description: https://datasheet.ciiva.com/299/littelfuse-fuse-458-series-299806.pdf?src-supplier=Digi-Key; Supplier 2: Farnell; Supplier Part Number 2: 1702533; Stock 2: 1620; Supplier 3: Digi-Key; Supplier Part Number 3: F2931CT-ND; Stock 3: 14221; Pricing 3: 1 = 1.43000, 5 = 1.38400, 10 = 1.29500, 50 = 1.07180, 100 = 0.89320, 250 = 0.87088, 500 = 0.73690 (USD)
J10 = 691321100002: WR-TBL Series 3211 - 3.50 mm Vertical PCB Header; Manufacturer: Wurth Electronics; Number of Positions Per Level: 2; Number of Levels: 1; Current: 10A; Voltage: 300V; Pitch: 0.138inch; Supplier: Mouser; Supplier Part Number: 710-691321100002; Manufacturer Part Number: 691321100002; RoHS: Yes; Category: Terminal Blocks; Stock: 2512; Pricing: 1=0.44, 10=0.394, 50=0.34, 100=0.305, 1000=0.269, 10000=0.268 (USD); Mounting Technology: Through Hole; Color: Green; Contact Material: Brass; Package Quantity: 1000; Packaging: Bulk; Number of Rows: 1; Termination: Solder; Number of Contacts: 2; Orientation: Vertical; Series: WR-TBL Series 3211; Voltage Rating: 300V; Length: 7mm; Width: 8.1mm; Height: 12.7mm; RoHS Compliant: Yes; Reach SVHC Compliant: Unknown; Lead Free: 5697LeadFree; ComponentLink1URL: https://datasheet.ciiva.com/8043/1442231-8043542.pdf?src-supplier=Element14; ComponentLink1Description: https://datasheet.ciiva.com/8043/1442231-8043542.pdf?src-supplier=Element14; ComponentLink2URL: https://datasheet.ciiva.com/795/6913211000xx-795780.pdf?src-supplier=Digikey; ComponentLink2Description: https://datasheet.ciiva.com/795/6913211000xx-795780.pdf?src-supplier=Digikey; ComponentLink3URL: https://datasheet.ciiva.com/48692/001088697-da-01-en-wr-tbl-terminal-block3211-691321100002-48692842.pdf?src-supplier=Conrad; ComponentLink3Description: https://datasheet.ciiva.com/48692/001088697-da-01-en-wr-tbl-terminal-block3211-691321100002-48692842.pdf?src-supplier=Conrad; Supplier 1: Mouser; Supplier Part Number 1: 710-691321100002; Supplier 2: Farnell; Supplier Part Number 2: 1841308; Supplier 3: Digikey; Supplier Part Number 3: 732-2763-ND

## Nets that join several sheets
+3V3: MCU (17 pins), SMPS_3V3 (11 pins)
+24V: MCU (J2.6 J11.6), Relays (18 pins), SMPS_3V3 (12 pins), Power_input (C31.1 D15.1 F1.2)
GND: MCU (28 pins), Relays (12 pins), SMPS_3V3 (28 pins), Power_input (C31.2 D15.2 J10.2)
PG_3V3: MCU (Q1.3 U1.4), SMPS_3V3 (Q8.1 R30.2 U3.2)
RELAY_1: MCU (U1.17), Relays (R7.1 R9.1)
RELAY_2: MCU (U1.19), Relays (R8.1 R10.1)
RELAY_3: MCU (U1.18), Relays (R11.1 R14.1)
RELAY_4: MCU (U1.16), Relays (R12.1 R15.1)
RELAY_5: MCU (U1.12), Relays (R19.1 R22.1)
RELAY_6: MCU (U1.11), Relays (R20.1 R23.1)